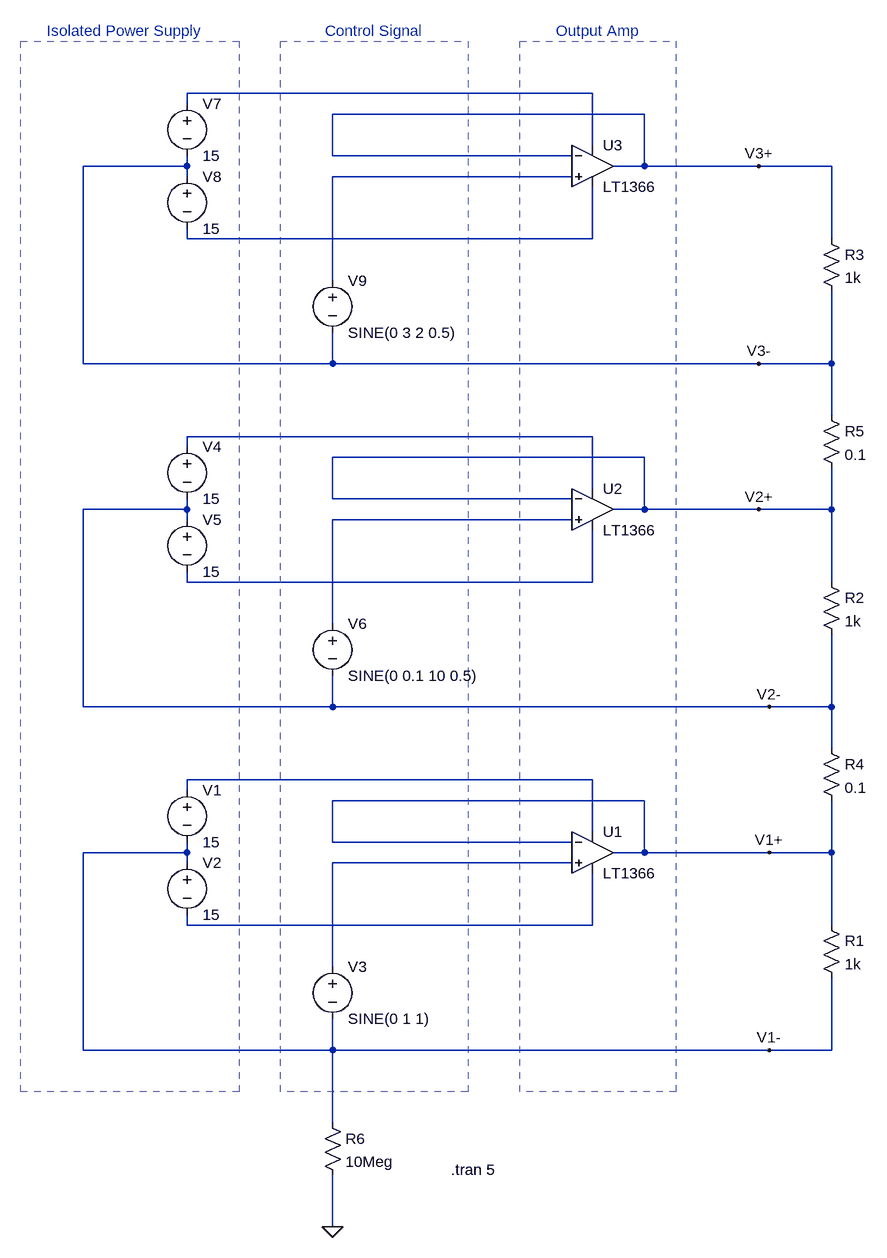
[diagram p0: schematic basic.asc]
basic.asc, the LTspice schematic file:
Version 4
SHEET 1 1032 756
WIRE 608 -1040 -16 -1040
WIRE -16 -1024 -16 -1040
WIRE 688 -1008 208 -1008
WIRE 608 -960 608 -1040
WIRE 208 -944 208 -1008
WIRE 576 -944 208 -944
WIRE -16 -928 -16 -944
WIRE -16 -928 -176 -928
WIRE 688 -928 688 -1008
WIRE 688 -928 640 -928
WIRE 864 -928 688 -928
WIRE 976 -928 864 -928
WIRE -16 -912 -16 -928
WIRE 576 -912 208 -912
WIRE -16 -816 -16 -832
WIRE 608 -816 608 -896
WIRE 608 -816 -16 -816
WIRE 976 -816 976 -928
WIRE 208 -752 208 -912
WIRE -176 -624 -176 -928
WIRE 208 -624 208 -672
WIRE 208 -624 -176 -624
WIRE 864 -624 208 -624
WIRE 976 -624 976 -736
WIRE 976 -624 864 -624
WIRE 976 -544 976 -624
WIRE 608 -512 -16 -512
WIRE -16 -496 -16 -512
WIRE 688 -480 208 -480
WIRE 608 -432 608 -512
WIRE 208 -416 208 -480
WIRE 576 -416 208 -416
WIRE -16 -400 -16 -416
WIRE -16 -400 -176 -400
WIRE 688 -400 688 -480
WIRE 688 -400 640 -400
WIRE 864 -400 688 -400
WIRE 976 -400 976 -464
WIRE 976 -400 864 -400
WIRE -16 -384 -16 -400
WIRE 576 -384 208 -384
WIRE -16 -288 -16 -304
WIRE 608 -288 608 -368
WIRE 608 -288 -16 -288
WIRE 976 -288 976 -400
WIRE 208 -224 208 -384
WIRE -176 -96 -176 -400
WIRE 208 -96 208 -144
WIRE 208 -96 -176 -96
WIRE 880 -96 208 -96
WIRE 976 -96 976 -208
WIRE 976 -96 880 -96
WIRE 976 -32 976 -96
WIRE 608 16 -16 16
WIRE -16 32 -16 16
WIRE 688 48 208 48
WIRE 608 96 608 16
WIRE 208 112 208 48
WIRE 576 112 208 112
WIRE -16 128 -16 112
WIRE -16 128 -176 128
WIRE 688 128 688 48
WIRE 688 128 640 128
WIRE 880 128 688 128
WIRE 976 128 976 48
WIRE 976 128 880 128
WIRE -16 144 -16 128
WIRE 576 144 208 144
WIRE -16 240 -16 224
WIRE 608 240 608 160
WIRE 608 240 -16 240
WIRE 976 240 976 128
WIRE 208 304 208 144
WIRE -176 432 -176 128
WIRE 208 432 208 384
WIRE 208 432 -176 432
WIRE 880 432 208 432
WIRE 976 432 976 320
WIRE 976 432 880 432
WIRE 208 544 208 432
WIRE 208 704 208 624
FLAG 208 704 0
FLAG 880 128 V1+
FLAG 880 432 V1-
FLAG 880 -96 V2-
FLAG 864 -400 V2+
FLAG 864 -928 V3+
FLAG 864 -624 V3-
SYMBOL voltage -16 16 R0
WINDOW 123 0 0 Left 0
WINDOW 39 0 0 Left 0
SYMATTR InstName V1
SYMATTR Value 15
SYMBOL Opamps\\LT1366 608 64 R0
SYMATTR InstName U1
SYMBOL voltage -16 128 R0
WINDOW 123 0 0 Left 0
WINDOW 39 0 0 Left 0
SYMATTR InstName V2
SYMATTR Value 15
SYMBOL voltage 208 288 R0
WINDOW 123 0 0 Left 0
WINDOW 39 0 0 Left 0
SYMATTR InstName V3
SYMATTR Value SINE(0 1 1)
SYMBOL res 960 224 R0
SYMATTR InstName R1
SYMATTR Value 1k
SYMBOL voltage -16 -512 R0
WINDOW 123 0 0 Left 0
WINDOW 39 0 0 Left 0
SYMATTR InstName V4
SYMATTR Value 15
SYMBOL Opamps\\LT1366 608 -464 R0
SYMATTR InstName U2
SYMBOL voltage -16 -400 R0
WINDOW 123 0 0 Left 0
WINDOW 39 0 0 Left 0
SYMATTR InstName V5
SYMATTR Value 15
SYMBOL voltage 208 -240 R0
WINDOW 123 0 0 Left 0
WINDOW 39 0 0 Left 0
SYMATTR InstName V6
SYMATTR Value SINE(0 0.1 10 0.5)
SYMBOL res 960 -304 R0
SYMATTR InstName R2
SYMATTR Value 1k
SYMBOL res 960 -48 R0
SYMATTR InstName R4
SYMATTR Value 0.1
SYMBOL voltage -16 -1040 R0
WINDOW 123 0 0 Left 0
WINDOW 39 0 0 Left 0
SYMATTR InstName V7
SYMATTR Value 15
SYMBOL Opamps\\LT1366 608 -992 R0
SYMATTR InstName U3
SYMBOL voltage -16 -928 R0
WINDOW 123 0 0 Left 0
WINDOW 39 0 0 Left 0
SYMATTR InstName V8
SYMATTR Value 15
SYMBOL voltage 208 -768 R0
WINDOW 123 0 0 Left 0
WINDOW 39 0 0 Left 0
SYMATTR InstName V9
SYMATTR Value SINE(0 3 2 0.5)
SYMBOL res 960 -832 R0
SYMATTR InstName R3
SYMATTR Value 1k
SYMBOL res 960 -560 R0
SYMATTR InstName R5
SYMATTR Value 0.1
SYMBOL res 192 528 R0
SYMATTR InstName R6
SYMATTR Value 10Meg
TEXT 390 616 Left 2 !.tran 5
TEXT -112 -1136 Center 2 ;Isolated Power Supply
TEXT 272 -1136 Center 2 ;Control Signal
TEXT 552 -1136 Left 2 ;Output Amp
RECTANGLE Normal 64 496 -272 -1120 2
RECTANGLE Normal 416 496 128 -1120 2
RECTANGLE Normal 736 496 496 -1120 2

The netlist it stands for:
* basic.asc
V1 N007 V1- 15
XU1 N008 V1+ N007 N009 V1+ LT1366  ; pins In+ In- V+ V- OUT
V2 V1- N009 15
V3 N008 V1- SINE(0 1 1)
R1 V1+ V1- 1k
V4 N004 V2- 15
XU2 N005 V2+ N004 N006 V2+ LT1366  ; pins In+ In- V+ V- OUT
V5 V2- N006 15
V6 N005 V2- SINE(0 0.1 10 0.5)
R2 V2+ V2- 1k
R4 V2- V1+ 0.1
V7 N001 V3- 15
XU3 N002 V3+ N001 N003 V3+ LT1366  ; pins In+ In- V+ V- OUT
V8 V3- N003 15
V9 N002 V3- SINE(0 3 2 0.5)
R3 V3+ V3- 1k
R5 V3- V2+ 0.1
R6 V1- 0 10Meg
.tran 5
* Isolated Power Supply
* Control Signal
* Output Amp
.lib LTC.lib
.backanno
.end